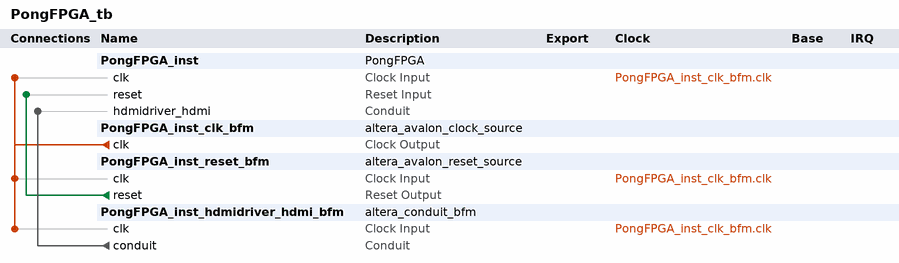
[diagram p0: system contents]
# Platform Designer (Qsys) system PongFPGA_tb, MAX 10 10M08DAF256C8G
# Parameters at their usual value, and those the tool derives, are not listed.
package require -exact qsys 18.1
create_system PongFPGA_tb
set_project_property DEVICE_FAMILY {MAX 10}
set_project_property DEVICE 10M08DAF256C8G

add_instance PongFPGA_inst PongFPGA 1.0

add_instance PongFPGA_inst_clk_bfm altera_avalon_clock_source 18.1
set_instance_parameter_value PongFPGA_inst_clk_bfm CLOCK_RATE 10000000

add_instance PongFPGA_inst_reset_bfm altera_avalon_reset_source 18.1
set_instance_parameter_value PongFPGA_inst_reset_bfm ASSERT_HIGH_RESET 0
set_instance_parameter_value PongFPGA_inst_reset_bfm INITIAL_RESET_CYCLES 50

add_instance PongFPGA_inst_hdmidriver_hdmi_bfm altera_conduit_bfm 18.1
set_instance_parameter_value PongFPGA_inst_hdmidriver_hdmi_bfm CLOCKED_SIGNAL true
set_instance_parameter_value PongFPGA_inst_hdmidriver_hdmi_bfm ENABLE_RESET false
set_instance_parameter_value PongFPGA_inst_hdmidriver_hdmi_bfm SIGNAL_DIRECTIONS input,input
set_instance_parameter_value PongFPGA_inst_hdmidriver_hdmi_bfm SIGNAL_ROLES output_clk,output_data
set_instance_parameter_value PongFPGA_inst_hdmidriver_hdmi_bfm SIGNAL_WIDTHS 1,3

# connections
add_connection PongFPGA_inst_clk_bfm.clk PongFPGA_inst.clk clock
add_connection PongFPGA_inst_clk_bfm.clk PongFPGA_inst_hdmidriver_hdmi_bfm.clk clock
add_connection PongFPGA_inst_clk_bfm.clk PongFPGA_inst_reset_bfm.clk clock
add_connection PongFPGA_inst_reset_bfm.reset PongFPGA_inst.reset reset
add_connection PongFPGA_inst_hdmidriver_hdmi_bfm.conduit PongFPGA_inst.hdmidriver_hdmi conduit

set_interconnect_requirement {$system} qsys_mm.clockCrossingAdapter HANDSHAKE
set_interconnect_requirement {$system} qsys_mm.enableEccProtection FALSE
set_interconnect_requirement {$system} qsys_mm.insertDefaultSlave FALSE
set_interconnect_requirement {$system} qsys_mm.maxAdditionalLatency 1

save_system PongFPGA_tb.qsys
